# EAGLE schematic master (EAGLE 6.5.0)
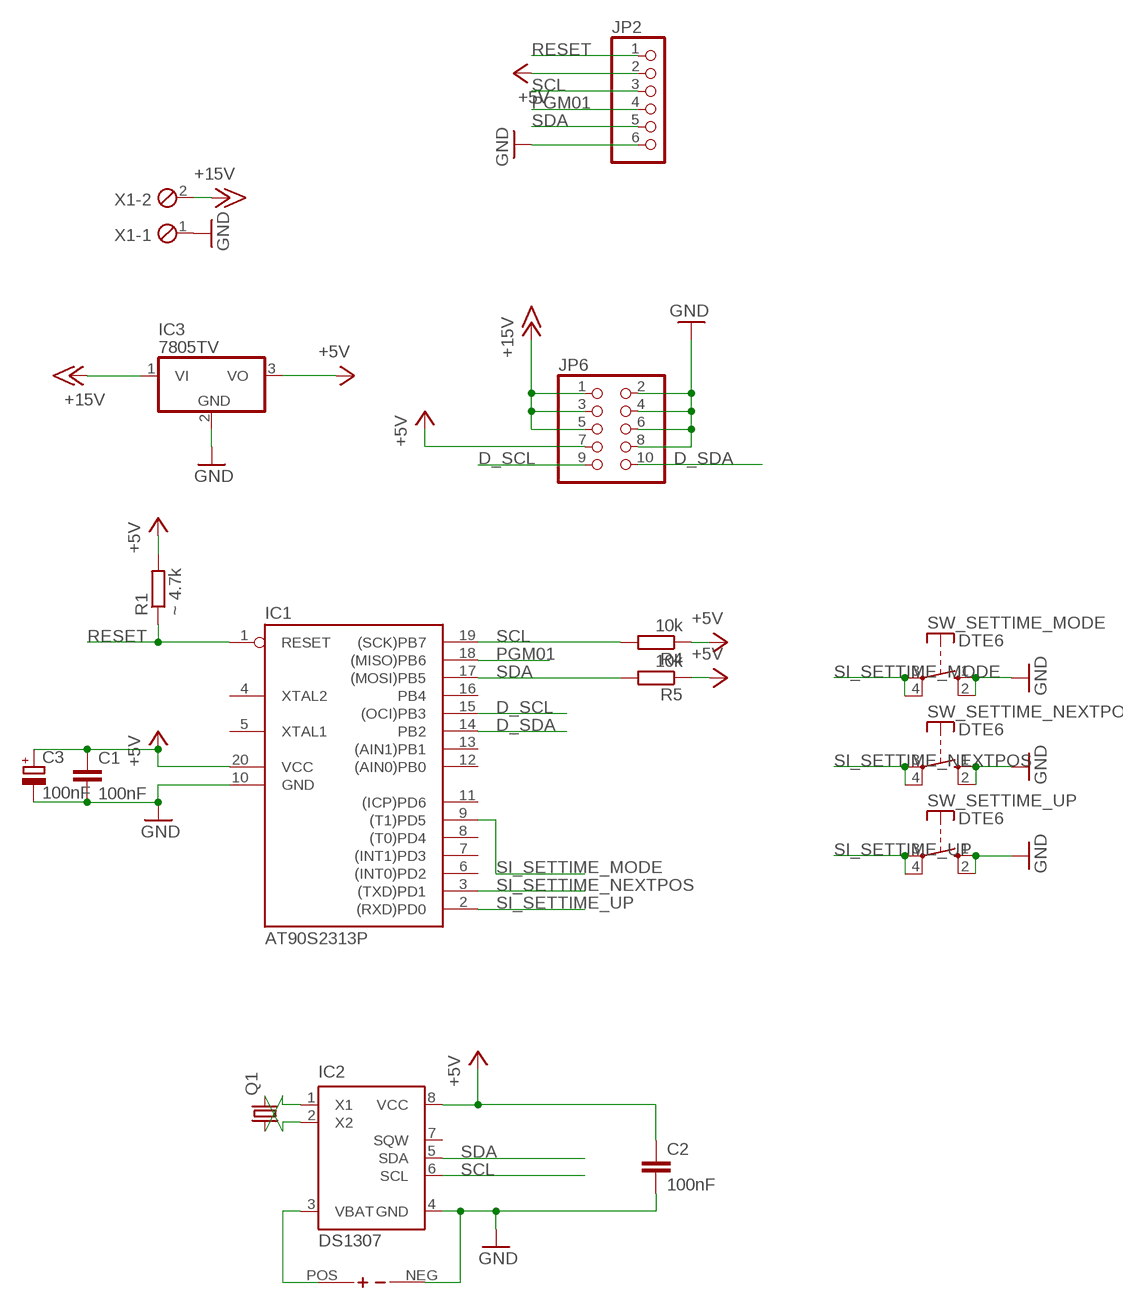
[diagram p0: schematic, sheet 1]

## Parts
C1  100nF  C-EUC0805  [C0805]
C2  100nF  C-EUC0805  [C0805]
C3  100nF  CPOL-EUE2.5-7  [E2,5-7]
IC1  AT90S2313P  [DIL20]
IC2  DS1307  [DIP-8]
IC3  7805TV  [TO220V]
JP2  PINHD-1X6  [1X06]
JP6  PINHD-2X5  [2X05]
Q1  CRYSTALQ-SMD-1MM  [Q-SMD-1MM]
R1  ~ 4.7k  R-EU_0207/10  [0207/10]
R4  10k  R-EU_0207/10  [0207/10]
R5  10k  R-EU_0207/10  [0207/10]
SW_SETTIME_MODE  DTE6  [DTE6]
SW_SETTIME_NEXTPOS  DTE6  [DTE6]
SW_SETTIME_UP  DTE6  [DTE6]
U$1  BATT  [BATT]
X1  MPT2  [2POL254]

## Nets
+5V: C1.1 C2.1 C3.+ IC1.20(VCC) IC2.8(VCC) IC3.3(VO) JP2.2 JP6.7 R1.2 R4.1 R5.1
+15V: IC3.1(VI) JP6.1 JP6.3 JP6.5 X1.2
D_SCL: IC1.15((OCI)PB3) JP6.9
D_SDA: IC1.14(PB2) JP6.10
GND: C1.2 C2.2 C3.- IC1.10(GND) IC2.4(GND) IC3.2(GND) JP2.6 JP6.2 JP6.4 JP6.6 JP6.8 SW_SETTIME_MODE.1(S) SW_SETTIME_MODE.2(S) SW_SETTIME_NEXTPOS.1(S) SW_SETTIME_NEXTPOS.2(S) SW_SETTIME_UP.1(S) SW_SETTIME_UP.2(S) U$1.NEG(V-) X1.1
N$2: IC2.1(X1) Q1.1
N$3: IC2.2(X2) Q1.2
PGM01: IC1.18((MISO)PB6) JP2.4
RESET: IC1.1(RESET) JP2.1 R1.1
SCL: IC1.19((SCK)PB7) IC2.6(SCL) JP2.3 R4.2
SDA: IC1.17((MOSI)PB5) IC2.5(SDA) JP2.5 R5.2
SI_SETTIME_MODE: IC1.9((T1)PD5) SW_SETTIME_MODE.3(P) SW_SETTIME_MODE.4(P)
SI_SETTIME_NEXTPOS: IC1.3((TXD)PD1) SW_SETTIME_NEXTPOS.3(P) SW_SETTIME_NEXTPOS.4(P)
SI_SETTIME_UP: IC1.2((RXD)PD0) SW_SETTIME_UP.3(P) SW_SETTIME_UP.4(P)
VBAT: IC2.3(VBAT) U$1.POS(V+)
Unconnected: IC1.4(XTAL2) IC1.5(XTAL1) IC1.6((INT0)PD2) IC1.7((INT1)PD3) IC1.8((T0)PD4) IC1.11((ICP)PD6) IC1.12((AIN0)PB0) IC1.13((AIN1)PB1) IC1.16(PB4) IC2.7(SQW)

## Library data of the parts
C1 C2 = rcl:C-EU: CAPACITOR, European symbol
C3 = rcl:CPOL-EU: POLARIZED CAPACITOR, European symbol
IC1 = atmel:AT90S2313: MICROCONTROLLER 2 Kbytes FLASH 128 bytes SRAM 128 bytes EEPROM UART; OC_FARNELL: unknown; OC_NEWARK: unknown
IC2 = DS1307:DS1307: DS1307 - 64×8, Serial, I2C Real Time Clock
IC3 = linear:78*: Positive VOLTAGE REGULATOR Source: http://cache.national.com/ds/LM/LM78L05.pdf http://www.fairchildsemi.com/ds/LM/LM7805.pdf
JP2 = pinhead:PINHD-1X6: PIN HEADER
JP6 = pinhead:PINHD-2X5: PIN HEADER
Q1 = smd-crystal:CRYSTAL: CRYSTAL; OC_FARNELL: unknown; OC_NEWARK: unknown
R1 R4 R5 = rcl:R-EU_: RESISTOR, European symbol
SW_SETTIME_MODE SW_SETTIME_NEXTPOS SW_SETTIME_UP = switch-misc:DT: ITT SWITCH
U$1 = batteryholder:BATT
X1 = con-phoenix-254:MPT2: PHOENIX CONNECTOR; OC_FARNELL: unknown; OC_NEWARK: unknown